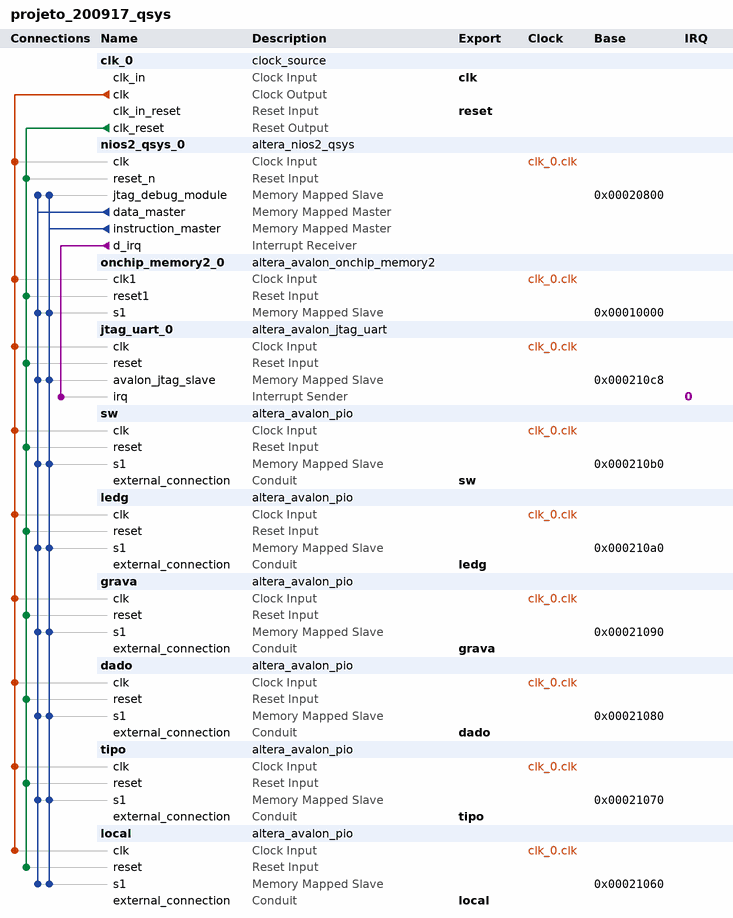
[diagram p0: system contents]
# Platform Designer (Qsys) system projeto_200917_qsys, Cyclone II EP2C35F672C6
# Parameters at their usual value, and those the tool derives, are not listed.
package require -exact qsys 13.0.1.99.2
create_system projeto_200917_qsys
set_project_property DEVICE_FAMILY {Cyclone II}
set_project_property DEVICE EP2C35F672C6

add_instance clk_0 clock_source 13.0
set_instance_parameter_value clk_0 clockFrequency 50000000

add_instance nios2_qsys_0 altera_nios2_qsys 13.0
set_instance_parameter_value nios2_qsys_0 resetSlave onchip_memory2_0.s1
set_instance_parameter_value nios2_qsys_0 mmu_TLBMissExcSlave None
set_instance_parameter_value nios2_qsys_0 exceptionSlave onchip_memory2_0.s1
set_instance_parameter_value nios2_qsys_0 breakSlave nios2_qsys_0.jtag_debug_module
set_instance_parameter_value nios2_qsys_0 impl Tiny
set_instance_parameter_value nios2_qsys_0 icache_size 4096

add_instance onchip_memory2_0 altera_avalon_onchip_memory2 13.0.1.99.2
set_instance_parameter_value onchip_memory2_0 dataWidth 32
set_instance_parameter_value onchip_memory2_0 dualPort false
set_instance_parameter_value onchip_memory2_0 initMemContent true
set_instance_parameter_value onchip_memory2_0 initializationFileName onchip_mem.hex
set_instance_parameter_value onchip_memory2_0 memorySize 40960

add_instance jtag_uart_0 altera_avalon_jtag_uart 13.0.1.99.2
set_instance_parameter_value jtag_uart_0 simInteractiveOptions NO_INTERACTIVE_WINDOWS

add_instance sw altera_avalon_pio 13.0.1.99.2
set_instance_parameter_value sw direction Input
set_instance_parameter_value sw width 8

add_instance ledg altera_avalon_pio 13.0.1.99.2
set_instance_parameter_value ledg direction Output
set_instance_parameter_value ledg width 8

add_instance grava altera_avalon_pio 13.0.1.99.2
set_instance_parameter_value grava direction Output
set_instance_parameter_value grava width 1

add_instance dado altera_avalon_pio 13.0.1.99.2
set_instance_parameter_value dado direction Output
set_instance_parameter_value dado width 4

add_instance tipo altera_avalon_pio 13.0.1.99.2
set_instance_parameter_value tipo direction Output
set_instance_parameter_value tipo width 2

add_instance local altera_avalon_pio 13.0.1.99.2
set_instance_parameter_value local direction Output
set_instance_parameter_value local width 3

# connections
add_connection clk_0.clk dado.clk clock
add_connection clk_0.clk grava.clk clock
add_connection clk_0.clk jtag_uart_0.clk clock
add_connection clk_0.clk ledg.clk clock
add_connection clk_0.clk local.clk clock
add_connection clk_0.clk nios2_qsys_0.clk clock
add_connection clk_0.clk onchip_memory2_0.clk1 clock
add_connection clk_0.clk sw.clk clock
add_connection clk_0.clk tipo.clk clock
add_connection clk_0.clk_reset dado.reset reset
add_connection clk_0.clk_reset grava.reset reset
add_connection clk_0.clk_reset jtag_uart_0.reset reset
add_connection clk_0.clk_reset ledg.reset reset
add_connection clk_0.clk_reset local.reset reset
add_connection clk_0.clk_reset nios2_qsys_0.reset_n reset
add_connection clk_0.clk_reset onchip_memory2_0.reset1 reset
add_connection clk_0.clk_reset sw.reset reset
add_connection clk_0.clk_reset tipo.reset reset
add_connection nios2_qsys_0.data_master dado.s1 avalon
set_connection_parameter_value nios2_qsys_0.data_master/dado.s1 baseAddress 0x00021080
add_connection nios2_qsys_0.data_master grava.s1 avalon
set_connection_parameter_value nios2_qsys_0.data_master/grava.s1 baseAddress 0x00021090
add_connection nios2_qsys_0.data_master jtag_uart_0.avalon_jtag_slave avalon
set_connection_parameter_value nios2_qsys_0.data_master/jtag_uart_0.avalon_jtag_slave baseAddress 0x000210c8
add_connection nios2_qsys_0.data_master ledg.s1 avalon
set_connection_parameter_value nios2_qsys_0.data_master/ledg.s1 baseAddress 0x000210a0
add_connection nios2_qsys_0.data_master local.s1 avalon
set_connection_parameter_value nios2_qsys_0.data_master/local.s1 baseAddress 0x00021060
add_connection nios2_qsys_0.data_master nios2_qsys_0.jtag_debug_module avalon
set_connection_parameter_value nios2_qsys_0.data_master/nios2_qsys_0.jtag_debug_module baseAddress 0x00020800
add_connection nios2_qsys_0.data_master onchip_memory2_0.s1 avalon
set_connection_parameter_value nios2_qsys_0.data_master/onchip_memory2_0.s1 baseAddress 0x00010000
add_connection nios2_qsys_0.data_master sw.s1 avalon
set_connection_parameter_value nios2_qsys_0.data_master/sw.s1 baseAddress 0x000210b0
add_connection nios2_qsys_0.data_master tipo.s1 avalon
set_connection_parameter_value nios2_qsys_0.data_master/tipo.s1 baseAddress 0x00021070
add_connection nios2_qsys_0.instruction_master dado.s1 avalon
set_connection_parameter_value nios2_qsys_0.instruction_master/dado.s1 baseAddress 0x00021080
add_connection nios2_qsys_0.instruction_master grava.s1 avalon
set_connection_parameter_value nios2_qsys_0.instruction_master/grava.s1 baseAddress 0x00021090
add_connection nios2_qsys_0.instruction_master jtag_uart_0.avalon_jtag_slave avalon
set_connection_parameter_value nios2_qsys_0.instruction_master/jtag_uart_0.avalon_jtag_slave baseAddress 0x000210c8
add_connection nios2_qsys_0.instruction_master ledg.s1 avalon
set_connection_parameter_value nios2_qsys_0.instruction_master/ledg.s1 baseAddress 0x000210a0
add_connection nios2_qsys_0.instruction_master local.s1 avalon
set_connection_parameter_value nios2_qsys_0.instruction_master/local.s1 baseAddress 0x00021060
add_connection nios2_qsys_0.instruction_master nios2_qsys_0.jtag_debug_module avalon
set_connection_parameter_value nios2_qsys_0.instruction_master/nios2_qsys_0.jtag_debug_module baseAddress 0x00020800
add_connection nios2_qsys_0.instruction_master onchip_memory2_0.s1 avalon
set_connection_parameter_value nios2_qsys_0.instruction_master/onchip_memory2_0.s1 baseAddress 0x00010000
add_connection nios2_qsys_0.instruction_master sw.s1 avalon
set_connection_parameter_value nios2_qsys_0.instruction_master/sw.s1 baseAddress 0x000210b0
add_connection nios2_qsys_0.instruction_master tipo.s1 avalon
set_connection_parameter_value nios2_qsys_0.instruction_master/tipo.s1 baseAddress 0x00021070
add_connection nios2_qsys_0.d_irq jtag_uart_0.irq interrupt
set_connection_parameter_value nios2_qsys_0.d_irq/jtag_uart_0.irq irqNumber 0

# exported interfaces
add_interface clk clock sink
set_interface_property clk EXPORT_OF clk_0.clk_in
add_interface reset reset sink
set_interface_property reset EXPORT_OF clk_0.clk_in_reset
add_interface sw conduit end
set_interface_property sw EXPORT_OF sw.external_connection
add_interface ledg conduit end
set_interface_property ledg EXPORT_OF ledg.external_connection
add_interface grava conduit end
set_interface_property grava EXPORT_OF grava.external_connection
add_interface tipo conduit end
set_interface_property tipo EXPORT_OF tipo.external_connection
add_interface local conduit end
set_interface_property local EXPORT_OF local.external_connection
add_interface dado conduit end
set_interface_property dado EXPORT_OF dado.external_connection

set_interconnect_requirement {$system} qsys_mm.clockCrossingAdapter HANDSHAKE
set_interconnect_requirement {$system} qsys_mm.maxAdditionalLatency 1

save_system projeto_200917_qsys.qsys
